# EAGLE design Akl-atmel (EAGLE 7.7.0)
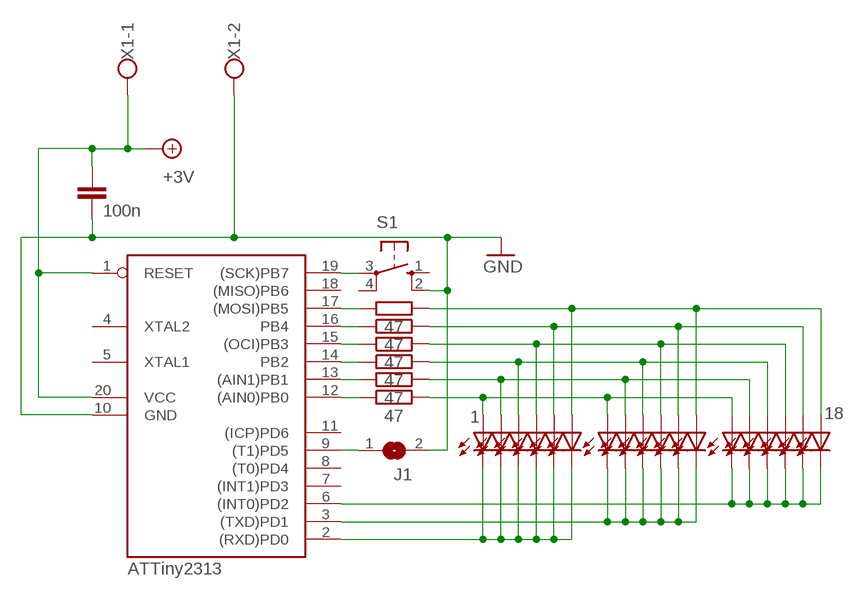
[diagram p0: schematic, sheet 1]

## Parts
C1  100n  C-EU025-025X050  [C025-025X050]
IC1  ATTiny2313  AT90S2313P  [DIL20]
J1  SJ  [SJ]
LED1  1  LED5MM  [LED5MM]
LED2  LED5MM  [LED5MM]
LED3  LED5MM  [LED5MM]
LED4  LED5MM  [LED5MM]
LED5  LED5MM  [LED5MM]
LED6  LED5MM  [LED5MM]
LED7  LED5MM  [LED5MM]
LED8  LED5MM  [LED5MM]
LED9  LED5MM  [LED5MM]
LED10  LED5MM  [LED5MM]
LED11  LED5MM  [LED5MM]
LED12  LED5MM  [LED5MM]
LED13  LED5MM  [LED5MM]
LED14  LED5MM  [LED5MM]
LED15  LED5MM  [LED5MM]
LED16  LED5MM  [LED5MM]
LED17  LED5MM  [LED5MM]
LED18  18  LED5MM  [LED5MM]
R1  47  R-EU_0207/7  [0207/7]
R2  47  R-EU_0207/7  [0207/7]
R3  47  R-EU_0207/7  [0207/7]
R4  47  R-EU_0207/7  [0207/7]
R5  47  R-EU_0207/7  [0207/7]
R6  47  R-EU_0207/7  [0207/7]
S1  10-XX  [B3F-10XX]
X1  CON2-RIA057  [RIA_057_02]

## Nets
+9V: C1.1 IC1.1(RESET) IC1.20(VCC) X1.1 ; supply symbol labelled +3V
GND: C1.2 IC1.10(GND) J1.2 S1.2(S1) X1.2
N$1: IC1.17((MOSI)PB5) R1.1
N$2: IC1.16(PB4) R2.1
N$3: IC1.15((OCI)PB3) R3.1
N$4: IC1.14(PB2) R4.1
N$5: IC1.13((AIN1)PB1) R5.1
N$6: IC1.12((AIN0)PB0) R6.1
N$7: LED1.A LED7.A LED13.A R6.2
N$8: LED2.A LED8.A LED14.A R5.2
N$9: LED3.A LED9.A LED15.A R4.2
N$10: LED4.A LED10.A LED16.A R3.2
N$11: LED5.A LED11.A LED17.A R2.2
N$12: LED6.A LED12.A LED18.A R1.2
N$13: IC1.2((RXD)PD0) LED1.K(C) LED2.K(C) LED3.K(C) LED4.K(C) LED5.K(C) LED6.K(C)
N$14: IC1.3((TXD)PD1) LED7.K(C) LED8.K(C) LED9.K(C) LED10.K(C) LED11.K(C) LED12.K(C)
N$15: IC1.6((INT0)PD2) LED13.K(C) LED14.K(C) LED15.K(C) LED16.K(C) LED17.K(C) LED18.K(C)
N$16: IC1.19((SCK)PB7) S1.3(P)
N$17: IC1.9((T1)PD5) J1.1
Unconnected: IC1.4(XTAL2) IC1.5(XTAL1) IC1.7((INT1)PD3) IC1.8((T0)PD4) IC1.11((ICP)PD6) IC1.18((MISO)PB6) S1.1(S) S1.4(P1)

## Library data of the parts
C1 = rcl:C-EU: CAPACITOR, European symbol
IC1 = atmel:AT90S2313: MICROCONTROLLER 2 Kbytes FLASH 128 bytes SRAM 128 bytes EEPROM UART
J1 = jumper:SJ: SMD solder JUMPER
LED1-LED18 = led:LED: LED OSRAM: - CHIPLED LG R971, LG N971, LY N971, LG Q971, LY Q971, LO R971, LY R971 LH N974, LH R974 LS Q976, LO Q976, LY Q976 LO Q996 - Hyper CHIPLED LW Q18S LB Q993, LB Q99A, LB R99A - SideLED LS A670, LO A670, LY A670, LG A670, LP A670 LB A673, LV A673, LT A673, LW A673 LH A674 LY A675 LS A676, LA A676, LO A676, LY A676, LW A676 LS A679, LY A679, LG A679 - Hyper Micro SIDELED® LS Y876, LA Y876, LO Y876, LY Y876 LT Y87S - SmartLED LW L88C, LW L88S LB L89C, LB L89S, LG L890 LS L89K, LO L89K, LY L89K LS L896, LA L896, LO L896, LY L896 - TOPLED LS T670, LO T670, LY T670, LG T670, LP T670 LSG T670, LSP T670, LSY T670, LOP T670, LYG T670 LG T671, LOG T671, LSG T671 LB T673, LV T673, LT T673, LW T673 LH T674 LS T676, LA T676, LO T676, LY T676, LB T676, LH T676, LSB T676, LW T676 LB T67C, LV T67C, LT T67C, LS T67K, LO T67K, LY T67K, LW E67C LS E67B, LA E67B, LO E67B, LY E67B, LB E67C, LV E67C, LT E67C LW T67C LS T679, LY T679, LG T679 LS T770, LO T770, LY T770, LG T770, LP T770 LB T773, LV T773, LT T773, LW T773 LH T774 LS E675, LA E675, LY E675, LS T675 LS T776, LA T776, LO T776, LY T776, LB T776 LHGB T686 LT T68C, LB T68C - Hyper Mini TOPLED® LB M676 - Mini TOPLED Santana® LG M470 LS M47K, LO M47K, LY M47K Source: http://www.osram.convergy.de/
R1-R6 = rcl:R-EU_: RESISTOR, European symbol
S1 = switch-omron:10-XX: OMRON SWITCH
X1 = con-terminal:CON2-

## Board
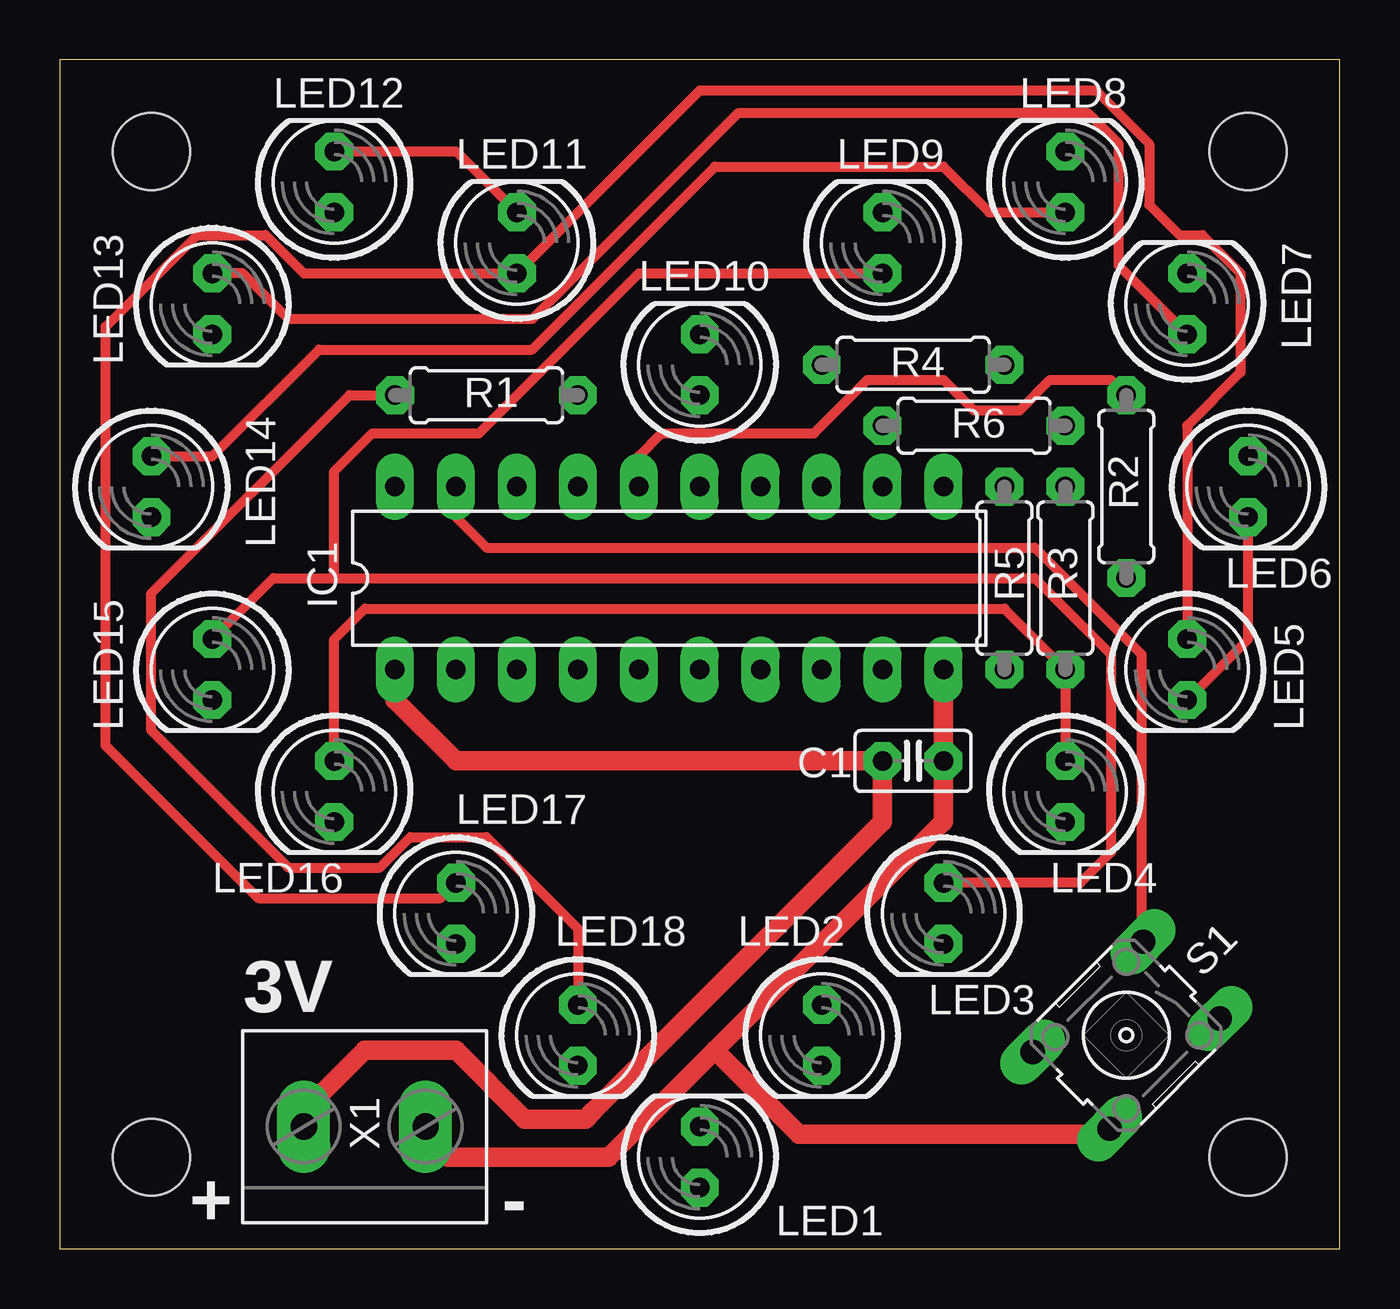
[diagram p1: board, top side]
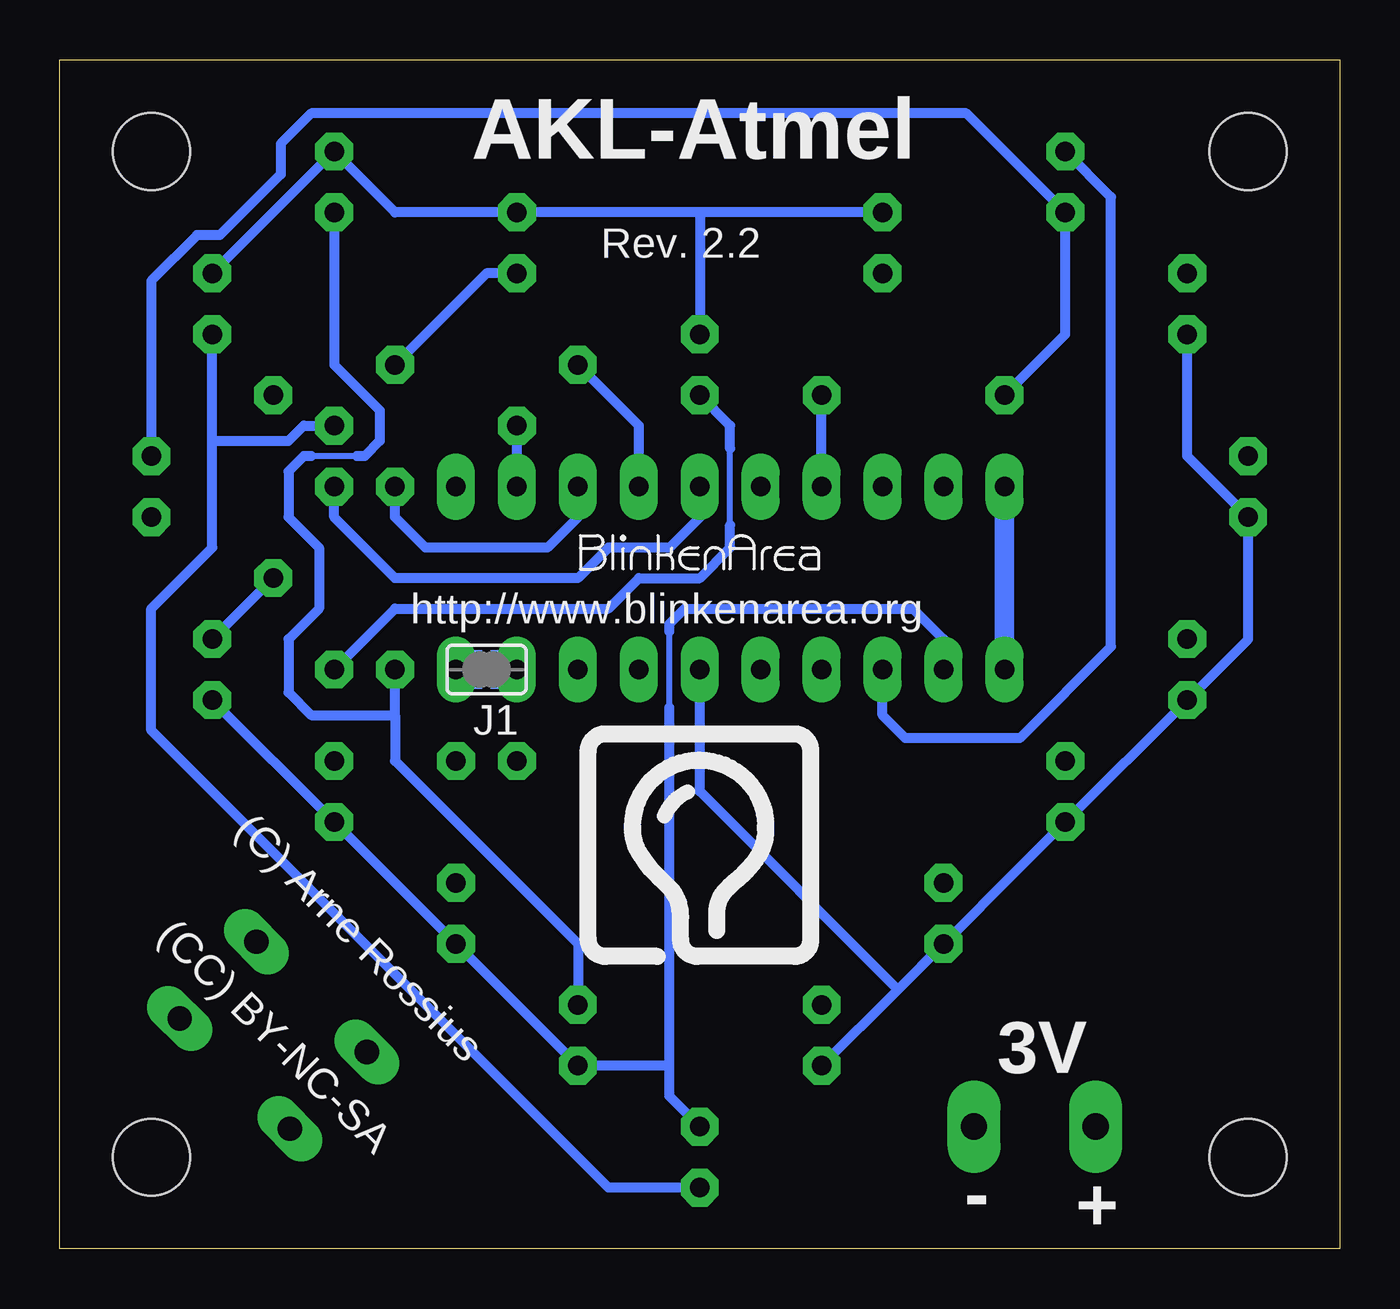
[diagram p2: board, bottom side, seen from below]

Size 53.34 x 49.53 mm. Coordinates in mm from the lower left corner, seen from the top.
Outline: 53.34,0 53.34,49.53 0,49.53 0,0 53.34,0
Copper layers (1*16): Top 0.035mm / dielectric 1.5mm / Bottom 0.035mm
Design rules "Bilex": minimum track width 10mil, minimum drill 24mil, track to track 10mil, track to pad 10mil, pad to pad 10mil, via to via 10mil, smd to smd 10mil, copper to edge 40mil, drill to drill 8mil, minimum pad ring 15mil, minimum via ring 8mil, stop-mask expansion 4mil, vias tented up to drill 0mil, thermal gap 10mil
Holes 3.2 mm at 3.81,45.72 49.53,3.81 49.53,45.72 3.81,3.81
vRestrict: area 0.3,0.3 to 7.3,7.3; area 0.3,42.2 to 7.3,49.2; area 46,42.2 to 53,49.2; area 46,0.3 to 53,7.3

### Footprints (pad centres in the part's own frame; a part is rotated, then mirrored left to right if it is on the bottom)
C025-025X050 = drill 0.813 octagon: 1 -1.27,0; 2 1.27,0
DIL20 = drill 0.813 long: 1 -11.43,-3.81; 2 -8.89,-3.81; 3 -6.35,-3.81; 4 -3.81,-3.81; 5 -1.27,-3.81; 6 1.27,-3.81; 7 3.81,-3.81; 8 6.35,-3.81; 9 8.89,-3.81; 10 11.43,-3.81; 11 11.43,3.81; 12 8.89,3.81; 13 6.35,3.81; 14 3.81,3.81; 15 1.27,3.81; 16 -1.27,3.81; 17 -3.81,3.81; 18 -6.35,3.81; 19 -8.89,3.81; 20 -11.43,3.81
SJ = smd 1.168 x 1.6: 1 -0.762,0; 2 0.762,0
LED5MM = drill 0.813 octagon: A -1.27,0; K 1.27,0
0207/7 = drill 0.813 octagon: 1 -3.81,0; 2 3.81,0
B3F-10XX = drill 1.016 long: 1 -3.251,2.261; 2 3.251,2.261; 3 -3.251,-2.261; 4 3.251,-2.261
RIA_057_02 = drill 1.1 pad 2.2 long: 1 -2.54,0; 2 2.54,0

### Placement (x,y rotation side)
C1  35.56,20.32 0 top
IC1  25.4,27.94 0 top
J1  35.56,24.13 180 bottom
LED1  26.67,3.81 90 top
LED2  31.75,8.89 270 top
LED3  36.83,13.97 270 top
LED4  41.91,19.05 270 top
LED5  46.99,24.13 270 top
LED6  49.53,31.75 270 top
LED7  46.99,39.37 90 top
LED8  41.91,44.45 90 top
LED9  34.29,41.91 90 top
LED10  26.67,36.83 90 top
LED11  19.05,41.91 90 top
LED12  11.43,44.45 90 top
LED13  6.35,39.37 270 top
LED14  3.81,31.75 270 top
LED15  6.35,24.13 270 top
LED16  11.43,19.05 270 top
LED17  16.51,13.97 270 top
LED18  21.59,8.89 270 top
R1  17.78,35.56 180 top
R2  44.45,31.75 270 top
R3  41.91,27.94 270 top
R4  35.56,36.83 0 top
R5  39.37,27.94 270 top
R6  38.1,34.29 0 top
S1  44.45,8.89 225 top
U$2  [LOGO_10MM_1]  26.67,16.83 0 bottom
U$3  [LOGO_10MM_2]  26.67,28.89 0 bottom
X1  12.7,5.08 0 top

### Tracks (layer width: path | path; a pad name or v marks a point on that pad's centre or on a via)
+9V
  Top 0.813: IC1.1 13.97,22.86 16.51,20.32 C1.1 34.29,17.78 22.23,5.71 21.91,5.4 19.37,5.4 16.51,8.26 12.7,8.26 10.16,5.71 X1.1
  Bottom 0.813: IC1.1 IC1.20
GND
  Top 0.813: 27.3,8.26 22.86,3.81 16.19,3.81 15.24,4.76 X1.2 | S1.2 43.52,4.76 30.8,4.76 27.3,8.26 | IC1.10 C1.2 36.83,17.78 27.3,8.26
  Bottom 0.406: IC1.10 J1.2
N$1
  Bottom 0.406: IC1.17 R1.1
N$2
  Top 0.406: R2.1 43.81,36.2 41.27,36.2 40.01,34.92 38.1,34.92 36.83,36.2 33.66,36.2 31.43,33.97 25.08,33.97 24.13,33.02 IC1.16
N$3
  Bottom 0.406: R3.1 41.91,30.48 39.37,27.94 31.75,27.94 30.48,29.21 27.94,29.21 26.67,30.48 IC1.15
N$4
  Bottom 0.406: R4.1 29.21,34.29 IC1.14
N$5
  Bottom 0.406: IC1.13 31.75,30.48 33.02,29.21 38.1,29.21 39.37,30.48 R5.1
N$6
  Bottom 0.406: IC1.12 R6.1
N$7
  Top 0.406: LED13.A 7.62,40.64 9.53,38.73 19.68,38.73 28.26,47.31 42.86,47.31 44.13,46.04 44.13,40.96 LED7.A
  Bottom 0.406: R6.2 43.18,34.29 43.81,33.66 46.99,33.66 | LED1.A 30.48,2.54 49.53,21.59 49.53,26.67 46.99,29.21 46.99,33.66 | 46.99,33.66 LED7.A
N$8
  Top 0.406: LED14.A 6.35,33.02 10.79,37.47 19.68,37.47 27.3,45.09 36.83,45.09 38.73,43.18 LED8.A
  Bottom 0.254: 40.96,33.02 42.86,33.02
  Bottom 0.406: LED2.A 31.75,12.7 39.37,20.32 39.37,22.23 | 39.37,22.23 R5.2 | LED8.A 41.91,36.83 40.01,34.92 40.01,33.66 40.64,33.02 40.96,33.02 | 42.86,33.02 43.18,33.02 43.81,32.38 43.81,30.48 42.55,29.21 42.55,26.67 43.81,25.4 43.81,23.18 42.86,22.23 39.37,22.23
N$9
  Top 0.406: LED15.A 8.89,27.94 11.43,27.94 | 11.43,27.94 11.43,32.38 13.02,33.97 17.46,33.97 24.13,40.64 LED9.A | LED3.A 42.55,15.24 43.81,16.51 43.81,24.77 40.64,27.94 11.43,27.94
  Bottom 0.406: R4.2 35.56,40.64 LED9.A
N$10
  Top 0.406: LED16.A 11.43,25.4 12.7,26.67 39.37,26.67 R3.2 LED4.A
  Bottom 0.254: 25.4,30.16 25.4,33.34
  Bottom 0.406: R3.2 39.37,26.67 30.48,26.67 29.21,27.94 26.67,27.94 25.4,29.21 25.4,30.16 | LED10.A 25.4,34.29 25.4,33.34
N$11
  Top 0.406: LED5.A 46.99,34.29 49.21,36.51 49.21,40.64 47.62,42.23 46.67,42.23 45.4,43.5 45.4,46.04 43.18,48.26 26.67,48.26 LED11.A 10.16,40.64 8.57,42.23 5.71,42.23 1.91,38.42 1.91,20.95 8.26,14.61 15.88,14.61 LED17.A
  Bottom 0.406: LED5.A R2.2
N$12
  Top 0.406: LED18.A 21.59,13.34 17.78,17.14 14.61,17.14 13.34,15.88 9.53,15.88 3.81,21.59 3.81,27.3 12.06,35.56 R1.2
  Bottom 0.406: R1.2 11.43,38.1 LED12.A 15.56,47.31 42.86,47.31 44.13,46.04 44.13,44.77 46.67,42.23 47.62,42.23 49.53,40.32 LED6.A
N$13
  Top 0.406: LED5.K 49.53,25.4 LED6.K
  Bottom 0.254: 27.94,22.54 27.94,25.72
  Bottom 0.406: LED1.K 27.94,6.35 27.94,7.62 | LED5.K LED4.K LED3.K LED2.K 27.94,7.62 | IC1.2 16.51,25.4 17.78,26.67 27.3,26.67 27.94,26.04 27.94,25.72 | 27.94,7.62 27.94,22.54
N$14
  Top 0.406: LED12.K 16.51,45.72 LED11.K
  Bottom 0.406: LED11.K 26.67,43.18 | 26.67,43.18 LED9.K 39.37,43.18 LED8.K LED7.K | 26.67,43.18 LED10.K | IC1.3 19.05,22.23 18.1,21.27 13.34,21.27 9.53,25.08 9.53,43.81 LED12.K
N$15
  Bottom 0.406: LED13.K 6.35,33.02 LED14.K 3.81,25.4 LED15.K LED16.K 18.41,10.79 | LED18.K 18.41,10.79 | 18.41,10.79 LED17.K | IC1.6 26.67,19.05 18.41,10.79
N$16
  Top 0.406: S1.3 45.09,12.72 45.09,24.77 40.64,29.21 17.78,29.21 16.51,30.48 IC1.19
N$17
  Bottom 0.406: IC1.9 J1.1

### Text on the board
tPlace: 3V | + | -
bPlace: AKL-Atmel | http://www.blinkenarea.org | (C) Arne Rossius | 3V | (CC) BY-NC-SA | + | -
bNames: Rev. 2.2
tNamesCopy: LED12 | LED8 | LED11 | LED9 | LED10 | LED13 | LED7 | R4 | R1 | R6 | R2 | LED14 | LED6 | IC1 | R5 | R3 | LED15 | LED5 | LED17 | LED16 | LED4 | C1 | LED18 | LED2 | S1 | LED3 | X1 | LED1
bNamesCopy: J1